# EAGLE design pneumatic_board2 (EAGLE 6.2)
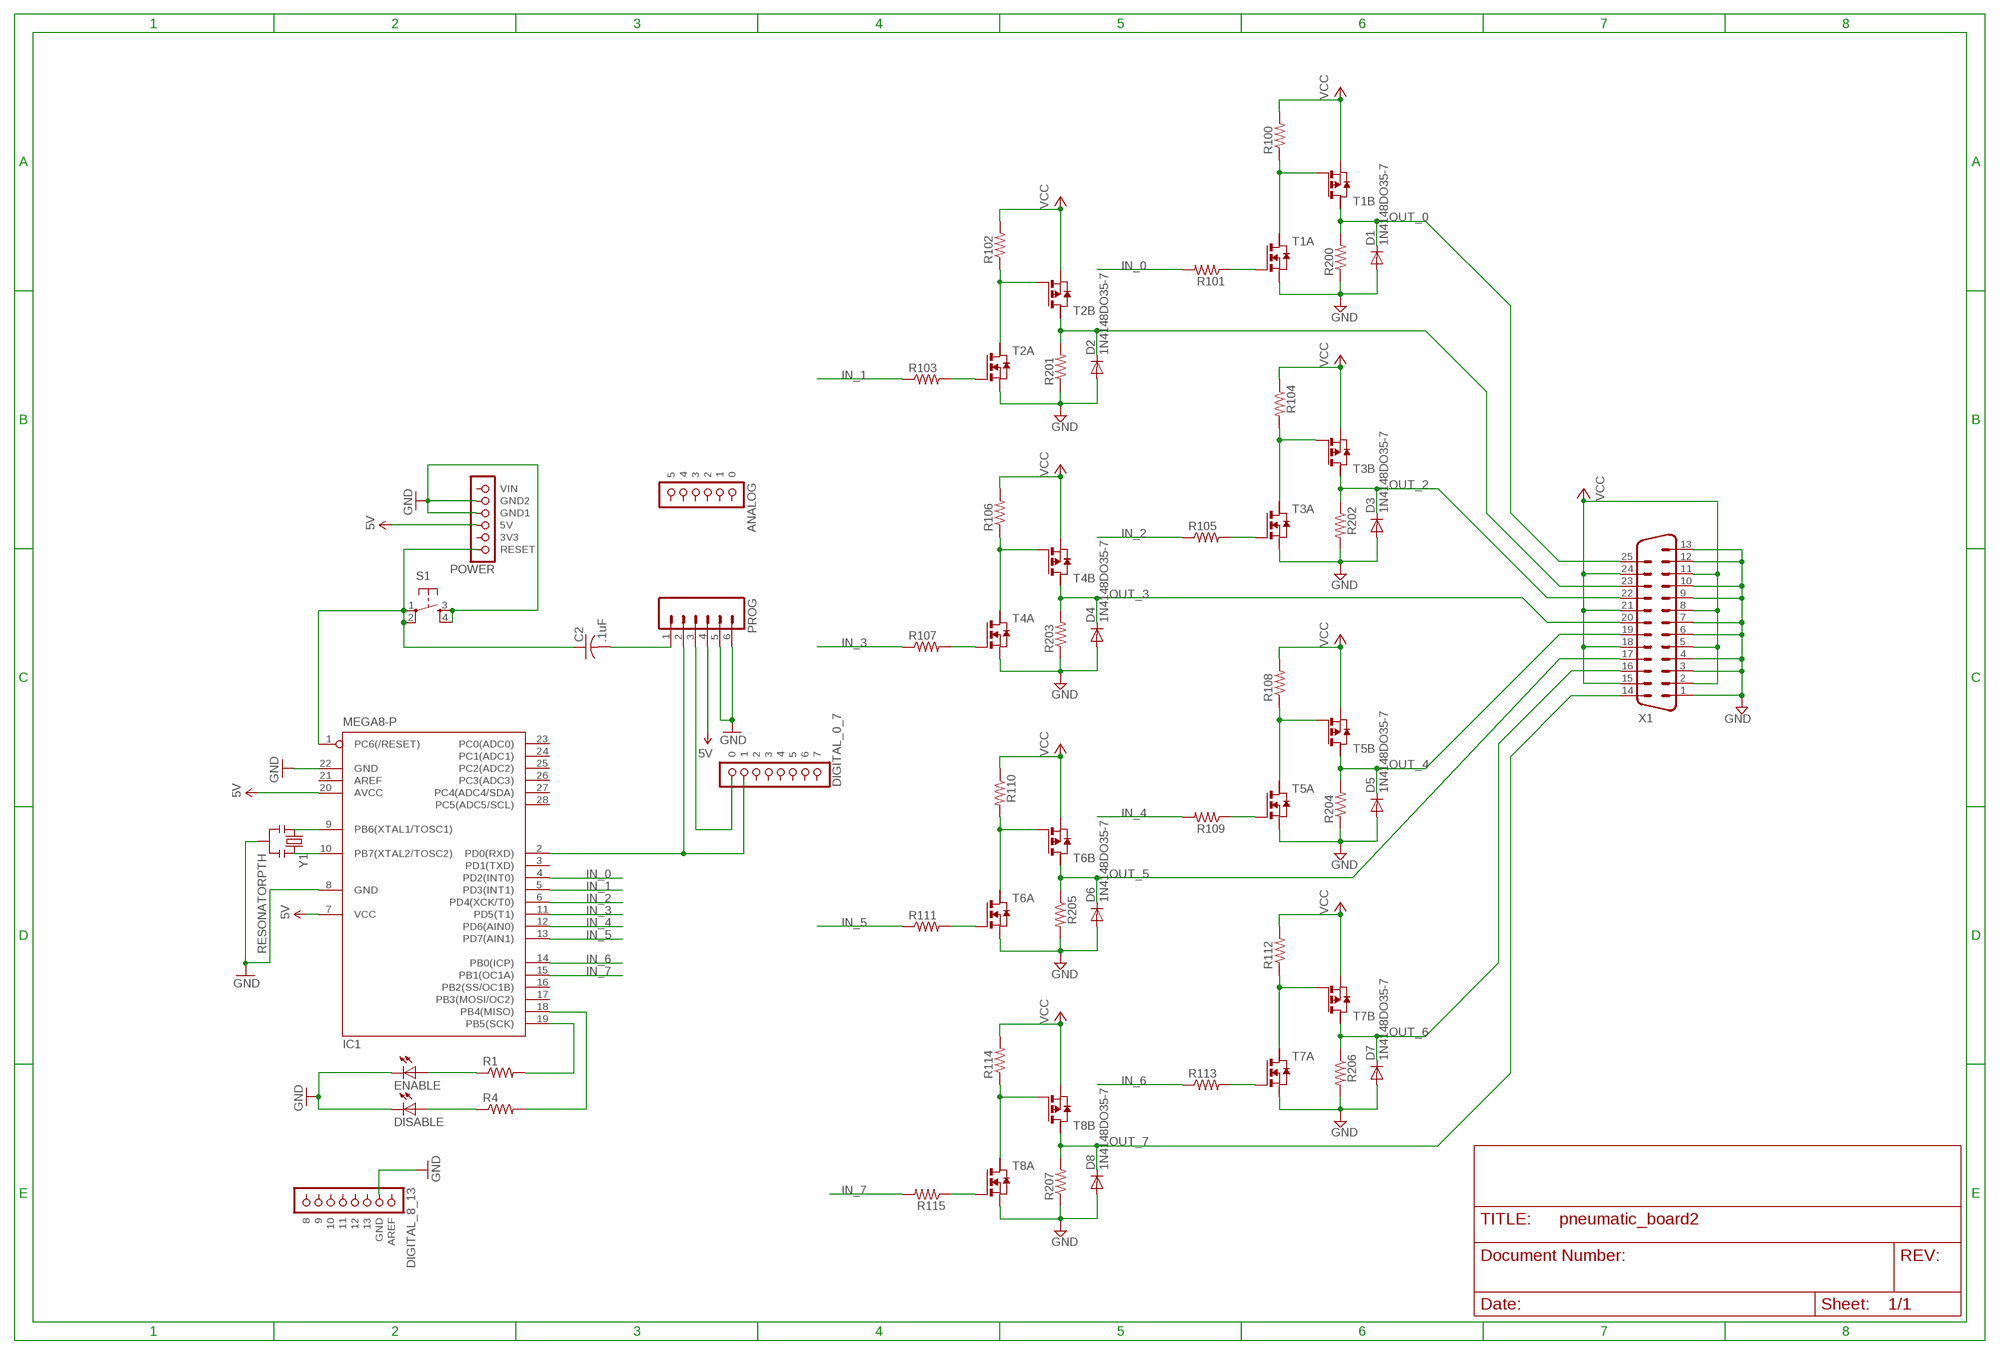
[diagram p0: schematic, sheet 1]

## Parts
C2  .1uF  C-US025-024X044  [C025-024X044]
D1  1N4148DO35-7  [DO35-7]
D2  1N4148DO35-7  [DO35-7]
D3  1N4148DO35-7  [DO35-7]
D4  1N4148DO35-7  [DO35-7]
D5  1N4148DO35-7  [DO35-7]
D6  1N4148DO35-7  [DO35-7]
D7  1N4148DO35-7  [DO35-7]
D8  1N4148DO35-7  [DO35-7]
DISABLE  LED5MM  [LED5MM]
ENABLE  LED5MM  [LED5MM]
IC1  MEGA8-P  [DIL28-3]
PROG  M06SIP_LOCK  [1X06-SIP_LOCK]
R1  RESISTORAXIAL-0.3  [AXIAL-0.3]
R4  RESISTORAXIAL-0.3  [AXIAL-0.3]
R100  RESISTORAXIAL-0.3  [AXIAL-0.3]
R101  RESISTORAXIAL-0.3  [AXIAL-0.3]
R102  RESISTORAXIAL-0.3  [AXIAL-0.3]
R103  RESISTORAXIAL-0.3  [AXIAL-0.3]
R104  RESISTORAXIAL-0.3  [AXIAL-0.3]
R105  RESISTORAXIAL-0.3  [AXIAL-0.3]
R106  RESISTORAXIAL-0.3  [AXIAL-0.3]
R107  RESISTORAXIAL-0.3  [AXIAL-0.3]
R108  RESISTORAXIAL-0.3  [AXIAL-0.3]
R109  RESISTORAXIAL-0.3  [AXIAL-0.3]
R110  RESISTORAXIAL-0.3  [AXIAL-0.3]
R111  RESISTORAXIAL-0.3  [AXIAL-0.3]
R112  RESISTORAXIAL-0.3  [AXIAL-0.3]
R113  RESISTORAXIAL-0.3  [AXIAL-0.3]
R114  RESISTORAXIAL-0.3  [AXIAL-0.3]
R115  RESISTORAXIAL-0.3  [AXIAL-0.3]
R200  RESISTORAXIAL-0.3  [AXIAL-0.3]
R201  RESISTORAXIAL-0.3  [AXIAL-0.3]
R202  RESISTORAXIAL-0.3  [AXIAL-0.3]
R203  RESISTORAXIAL-0.3  [AXIAL-0.3]
R204  RESISTORAXIAL-0.3  [AXIAL-0.3]
R205  RESISTORAXIAL-0.3  [AXIAL-0.3]
R206  RESISTORAXIAL-0.3  [AXIAL-0.3]
R207  RESISTORAXIAL-0.3  [AXIAL-0.3]
S1  TAC_SWITCHPTH  [TACTILE-PTH]
T1  PN_MOSFET-SO8  [SO8]
T2  PN_MOSFET-SO8  [SO8]
T3  PN_MOSFET-SO8  [SO8]
T4  PN_MOSFET-SO8  [SO8]
T5  PN_MOSFET-SO8  [SO8]
T6  PN_MOSFET-SO8  [SO8]
T7  PN_MOSFET-SO8  [SO8]
T8  PN_MOSFET-SO8  [SO8]
U$1  POWER  [1X06]
U$2  ANALOG  [1X06]
U$3  DIGITAL_0_7  [1X08]
U$4  DIGITAL_8_13  [1X08]
X1  M25VP  [M25VP]
Y1  RESONATORPTH  [RESONATOR-PTH]

## Nets
5V: IC1.7(VCC) IC1.20(AVCC) PROG.4 U$1.3(5V)
GND: D1.A D2.A D3.A D4.A D5.A D6.A D7.A D8.A DISABLE.K(C) ENABLE.K(C) IC1.8(GND) IC1.22(GND) PROG.5 PROG.6 R200.P$1 R201.P$1 R202.P$2 R203.P$1 R204.P$1 R205.P$2 R206.P$2 R207.P$1 S1.3 S1.4 T1.1(A:S) T2.1(A:S) T3.1(A:S) T4.1(A:S) T5.1(A:S) T6.1(A:S) T7.1(A:S) T8.1(A:S) U$1.4(GND1) U$1.5(GND2) U$4.2(GND) X1.1 X1.3 X1.4 X1.6 X1.7 X1.9 X1.10 X1.12 X1.13 Y1.2
IN_0: IC1.4(PD2(INT0)) R101.P$2
IN_1: IC1.5(PD3(INT1)) R103.P$1
IN_2: IC1.6(PD4(XCK/T0)) R105.P$1
IN_3: IC1.11(PD5(T1)) R107.P$1
IN_4: IC1.12(PD6(AIN0)) R109.P$2
IN_5: IC1.13(PD7(AIN1)) R111.P$1
IN_6: IC1.14(PB0(ICP)) R113.P$1
IN_7: IC1.15(PB1(OC1A)) R115.P$2
N$1: IC1.2(PD0(RXD)) PROG.2 U$3.7
N$2: IC1.9(PB6(XTAL1/TOSC1)) Y1.1
N$3: IC1.10(PB7(XTAL2/TOSC2)) Y1.3
N$4: IC1.19(PB5(SCK)) R1.P$2
N$5: IC1.18(PB4(MISO)) R4.P$2
N$7: R100.P$1 T1.4(B:G) T1.7(A:D)
N$8: R101.P$1 T1.2(A:G)
N$9: R104.P$2 T3.4(B:G) T3.7(A:D)
N$10: R102.P$1 T2.4(B:G) T2.7(A:D)
N$11: R103.P$2 T2.2(A:G)
N$14: R105.P$2 T3.2(A:G)
N$16: R106.P$1 T4.4(B:G) T4.7(A:D)
N$17: R107.P$2 T4.2(A:G)
N$19: R108.P$1 T5.4(B:G) T5.7(A:D)
N$20: R109.P$1 T5.2(A:G)
N$22: R110.P$2 T6.4(B:G) T6.7(A:D)
N$23: R111.P$2 T6.2(A:G)
N$24: PROG.3 U$3.8
N$25: ENABLE.A R1.P$1
N$26: DISABLE.A R4.P$1
N$27: R112.P$1 T7.4(B:G) T7.7(A:D)
N$29: R113.P$2 T7.2(A:G)
N$31: R114.P$1 T8.4(B:G) T8.7(A:D)
N$32: R115.P$1 T8.2(A:G)
N$33: C2.2 PROG.1
N$34: C2.1 IC1.1(PC6(/RESET)) S1.1 S1.2 U$1.1(RESET)
OUT_0: D1.C R200.P$2 T1.5(B:D) X1.25
OUT_1: D2.C R201.P$2 T2.5(B:D) X1.23
OUT_2: D3.C R202.P$1 T3.5(B:D) X1.22
OUT_3: D4.C R203.P$2 T4.5(B:D) X1.20
OUT_4: D5.C R204.P$2 T5.5(B:D) X1.19
OUT_5: D6.C R205.P$1 T6.5(B:D) X1.17
OUT_6: D7.C R206.P$1 T7.5(B:D) X1.16
OUT_7: D8.C R207.P$2 T8.5(B:D) X1.14
VCC: R100.P$2 R102.P$2 R104.P$1 R106.P$2 R108.P$2 R110.P$1 R112.P$2 R114.P$2 T1.3(B:S) T2.3(B:S) T3.3(B:S) T4.3(B:S) T5.3(B:S) T6.3(B:S) T7.3(B:S) T8.3(B:S) X1.2 X1.5 X1.8 X1.11 X1.15 X1.18 X1.21 X1.24
Unconnected: IC1.3(PD1(TXD)) IC1.16(PB2(SS/OC1B)) IC1.17(PB3(MOSI/OC2)) IC1.21(AREF) IC1.23(PC0(ADC0)) IC1.24(PC1(ADC1)) IC1.25(PC2(ADC2)) IC1.26(PC3(ADC3)) IC1.27(PC4(ADC4/SDA)) IC1.28(PC5(ADC5/SCL)) T1.6(B:D2) T1.8(A:D2) T2.6(B:D2) T2.8(A:D2) T3.6(B:D2) T3.8(A:D2) T4.6(B:D2) T4.8(A:D2) T5.6(B:D2) T5.8(A:D2) T6.6(B:D2) T6.8(A:D2) T7.6(B:D2) T7.8(A:D2) T8.6(B:D2) T8.8(A:D2) U$1.2(3V3) U$1.6(VIN) U$2.1 U$2.2 U$2.3 U$2.4 U$2.5 U$2.6 U$3.1 U$3.2 U$3.3 U$3.4 U$3.5 U$3.6 U$4.1(AREF) U$4.3 U$4.4 U$4.5 U$4.6 U$4.7 U$4.8 X1.G1 X1.G2

## Library data of the parts
C2 = rcl:C-US: CAPACITOR, American symbol
D1-D8 = diode:1N4148: DIODE high speed (Philips)
DISABLE ENABLE = SparkFun:LED: LEDs Standard schematic elements and footprints for 5mm, 3mm, 1206, and 0603 sized LEDs. 5mm - Spark Fun Electronics SKU : COM-00529 (and others)
IC1 = atmel:MEGA8-P: MICROCONTROLLER 8 Kbytes FLASH, 1 kbytes SRAM, 512 bytes EEPROM, USART, 4-channel 10 bit ADC, 2-channel 8 bit ADC Pin compatible with Atmega48, ATMega88, ATMega168 Source: avr.lbr; OC_FARNELL: unknown; OC_NEWARK: unknown
PROG = SparkFun:M06: Header 6 Standard 6-pin 0.1" header. Use with straight break away headers (SKU : PRT-00116), right angle break away headers (PRT-00553), swiss pins (PRT-00743), machine pins (PRT-00117), and female headers (PRT-00115). Molex polarized connector foot print use with SKU : PRT-08094 with associated crimp pins and housings. NOTES ON THE VARIANTS LOCK and LOCK_LONGPADS... This footprint was designed to help hold the alignment of a through-hole component (i.e. 6-pin header) while soldering it into place. You may notice that each hole has been shifted either up or down by 0.005 of an inch from it's more standard position (which is a perfectly straight line). This slight alteration caused the pins (the squares in the middle) to touch the edges of the holes. Because they are alternating, it causes a "brace" to hold the component in place. 0.005 has proven to be the perfect amount of "off-center" position when using our standard breakaway headers. Although looks a little odd when you look at the bare footprint, once you have a header in there, the alteration is very hard to notice. Also, if you push a header all the way into place, it is covered up entirely on the bottom side. This idea of altering the position of holes to aid alignment will be further integrated into the Sparkfun Library for other footprints. It can help hold any component with 3 or more connection pins.
R1 R4 R100-R115 R200-R207 = SparkFun:RESISTOR: Resistor Basic schematic elements and footprints for 0603, 1206, and PTH resistors.
S1 = SparkFun:TAC_SWITCH: Momentary Switch Button commonly used for reset or general input. Spark Fun Electronics SKU : COM-00097
T1-T8 = zetex:PN_MOSFET-: DUAL N AND P-CHANNEL ENHANCEMENT MODE MOSFET source ZXMD63C02.pdf from http://www.zetex.com/; OC_FARNELL: unknown; OC_NEWARK: unknown
U$1 = arduino:POWER
U$2 = arduino:ANALOG
U$3 = arduino:DIGITAL_0_7
U$4 = arduino:DIGITAL_8_13
X1 = con-subd:M25VP: SUB-D; OC_FARNELL: unknown; OC_NEWARK: unknown
Y1 = SparkFun:RESONATOR: Resonator Small SMD resonator. This is the itty bitty 10/20MHz resonators with built in caps. CSTCE10M0G55 and CSTCE20M0V53. Footprint has been reviewed closely but hasn't been tested yet.

## Board
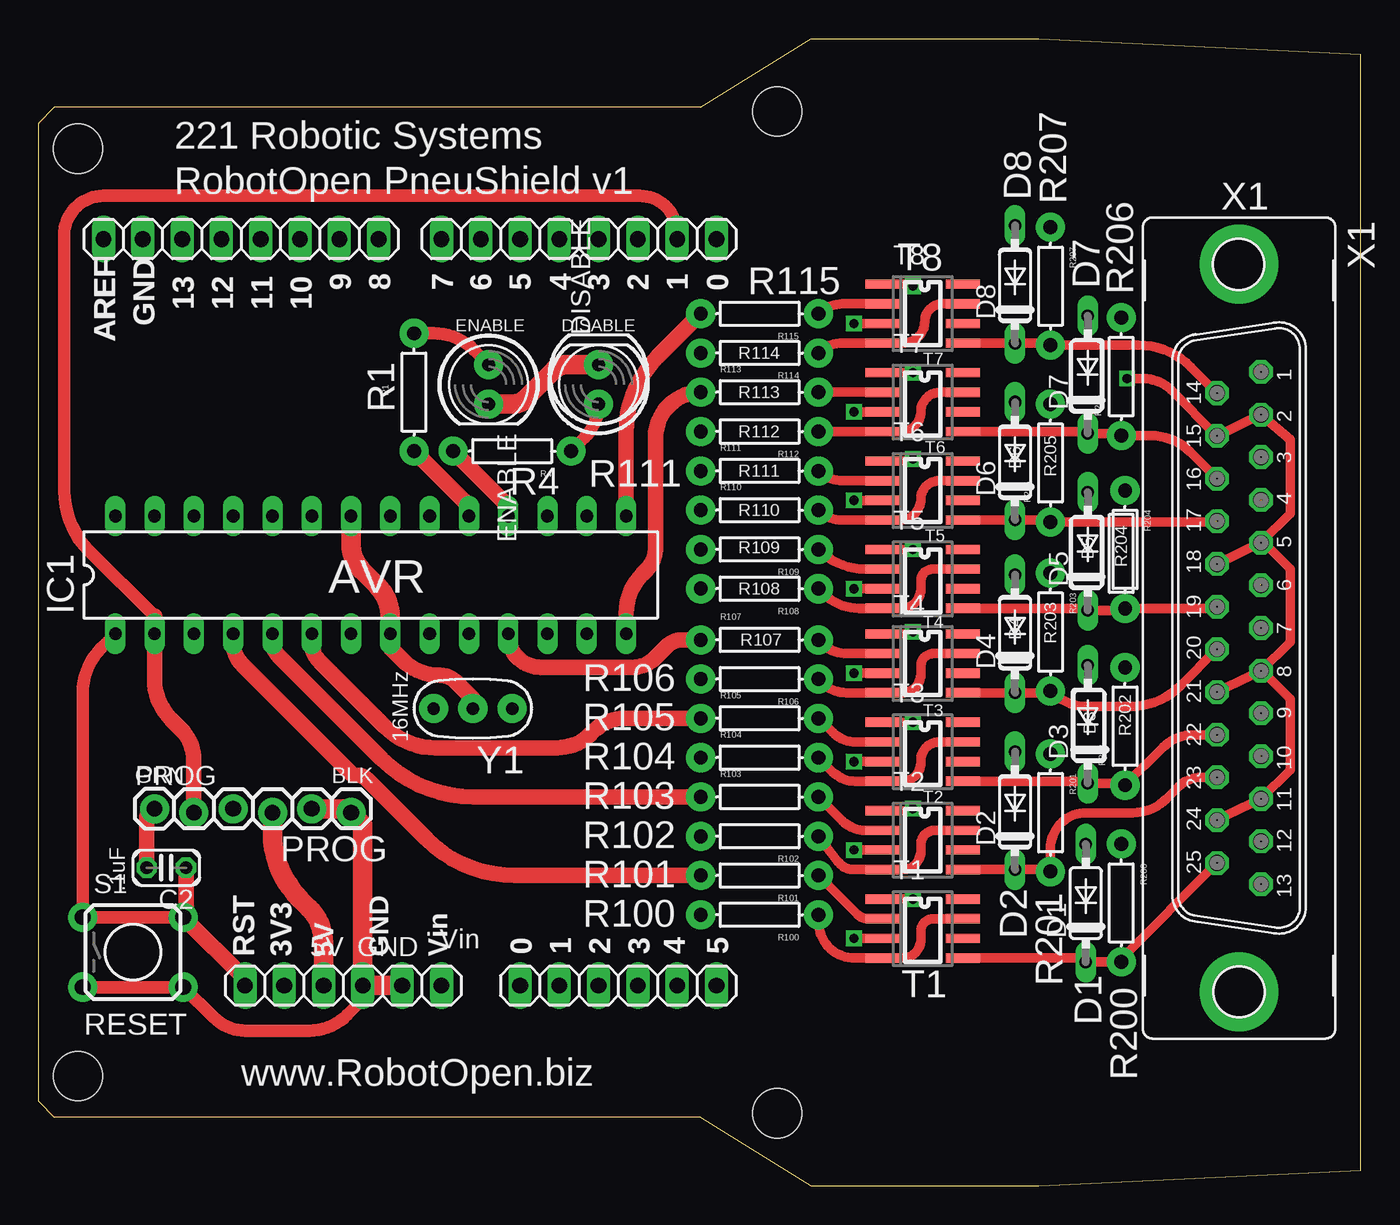
[diagram p1: board, top side]
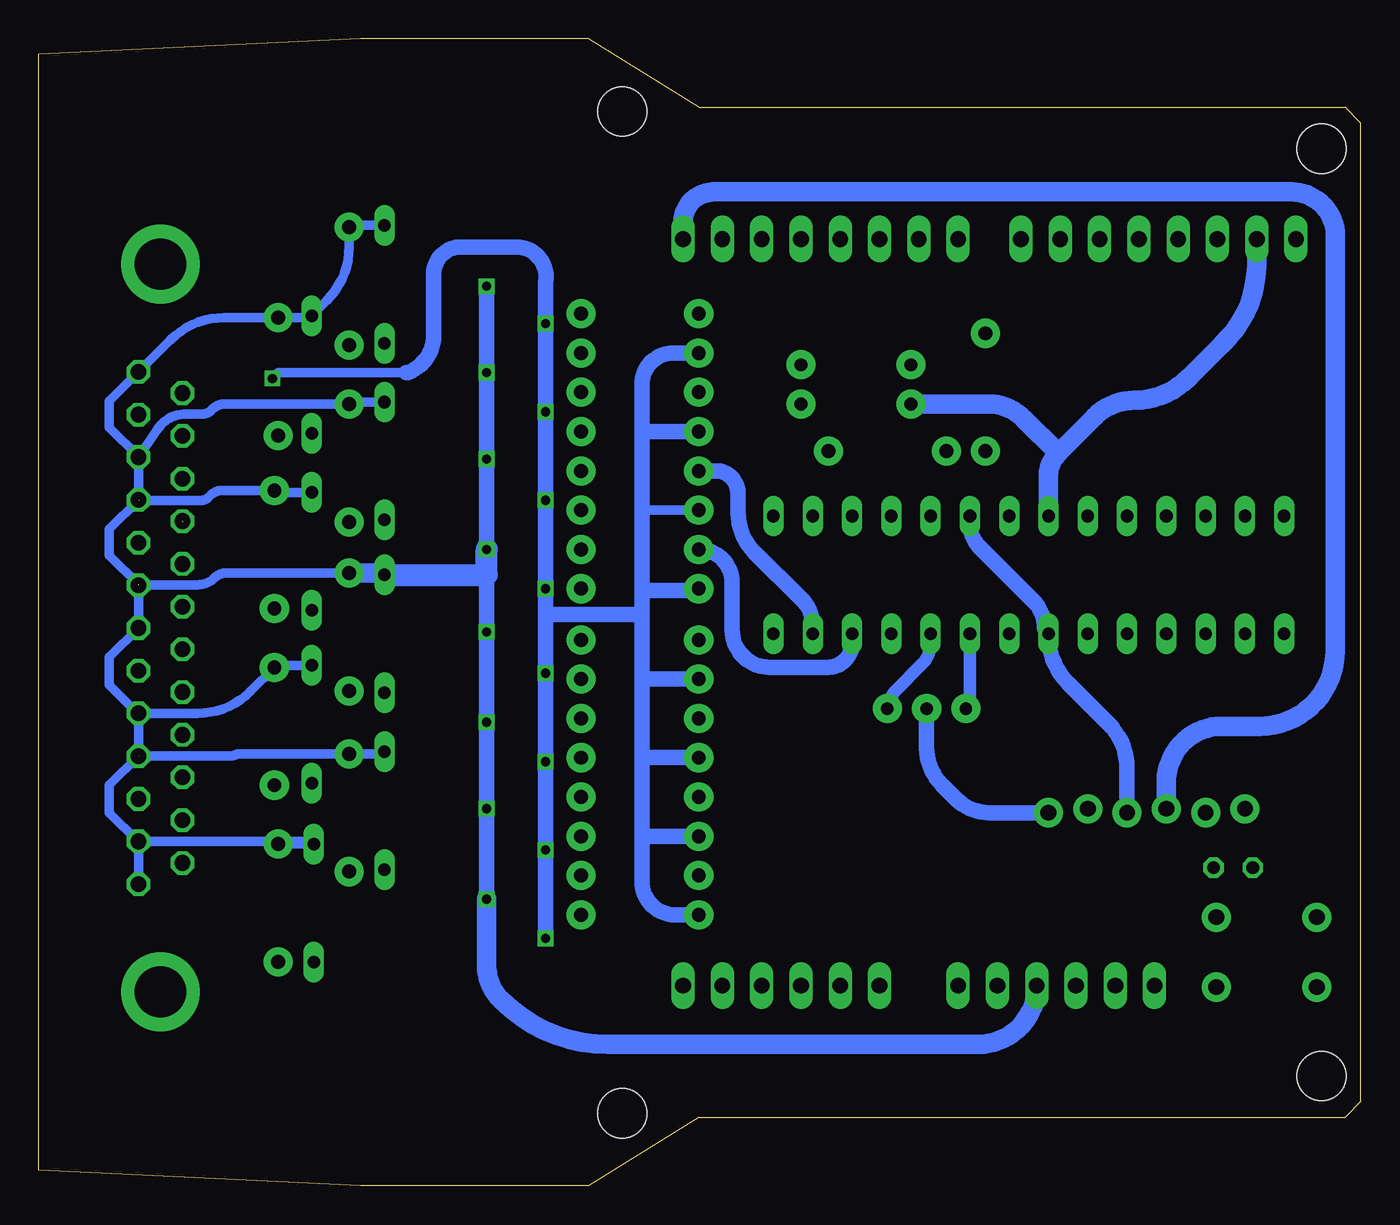
[diagram p2: board, bottom side, seen from below]

Size 85.47 x 74.17 mm. Coordinates in mm from the lower left corner, seen from the top.
Outline: 64.64,0 85.47,1.02 85.47,73.15 64.64,74.17 49.91,74.17 42.8,69.72 1.02,69.72 0,68.71 0,5.46 1.02,4.45 42.8,4.45 49.91,0 64.64,0
Copper layers (1*16): Top 0.035mm / dielectric 1.5mm / Bottom 0.035mm
Design rules: minimum track width 10mil, minimum drill 24mil, track to track 8mil, track to pad 8mil, pad to pad 8mil, via to via 8mil, smd to smd 8mil, copper to edge 40mil, drill to drill 8mil, minimum pad ring 10mil, minimum via ring 8mil, stop-mask expansion 4mil, vias tented up to drill 0mil, thermal gap 10mil
Holes 3.17 mm at 2.54,67.06 2.54,7.11 47.75,4.7 47.75,69.47

### Footprints (pad centres in the part's own frame; a part is rotated, then mirrored left to right if it is on the bottom)
C025-024X044 = drill 0.813 octagon: 1 -1.27,0; 2 1.27,0
DO35-7 = drill 0.813 long: A 3.81,0; C -3.81,0
LED5MM = drill 0.813 pad 1.88: A -1.27,0; K 1.27,0
DIL28-3 = drill 0.813 long: 1 -16.51,-3.81; 2 -13.97,-3.81; 3 -11.43,-3.81; 4 -8.89,-3.81; 5 -6.35,-3.81; 6 -3.81,-3.81; 7 -1.27,-3.81; 8 1.27,-3.81; 9 3.81,-3.81; 10 6.35,-3.81; 11 8.89,-3.81; 12 11.43,-3.81; 13 13.97,-3.81; 14 16.51,-3.81; 15 16.51,3.81; 16 13.97,3.81; 17 11.43,3.81; 18 8.89,3.81; 19 6.35,3.81; 20 3.81,3.81; 21 1.27,3.81; 22 -1.27,3.81; 23 -3.81,3.81; 24 -6.35,3.81; 25 -8.89,3.81; 26 -11.43,3.81; 27 -13.97,3.81; 28 -16.51,3.81
1X06-SIP_LOCK = drill 1.016 pad 1.88: 1 0,0; 2 2.54,-0.254; 3 5.08,0; 4 7.62,-0.254; 5 10.16,0; 6 12.7,-0.254
AXIAL-0.3 = drill 0.9 pad 1.88: P$1 -3.81,0; P$2 3.81,0
TACTILE-PTH = drill 1.016 pad 1.88: 1 -3.251,2.261; 2 3.251,2.261; 3 -3.251,-2.261; 4 3.251,-2.261
SO8 = smd 0.6 x 2.2: 1 -1.905,-2.6; 2 -0.635,-2.6; 3 0.635,-2.6; 4 1.905,-2.6; 5 1.905,2.6; 6 0.635,2.6; 7 -0.635,2.6; 8 -1.905,2.6
1X06 = drill 1.016 long: 1 -6.35,0; 2 -3.81,0; 3 -1.27,0; 4 1.27,0; 5 3.81,0; 6 6.35,0
1X08 = drill 1.016 long: 1 -8.89,0; 2 -6.35,0; 3 -3.81,0; 4 -1.27,0; 5 1.27,0; 6 3.81,0; 7 6.35,0; 8 8.89,0
M25VP = drill 1.016 octagon: 1 -16.561,1.422; 2 -13.792,1.422; 3 -11.049,1.422; 4 -8.28,1.422; 5 -5.512,1.422; 6 -2.769,1.422; 7 0,1.422; 8 2.769,1.422; 9 5.512,1.422; 10 8.28,1.422; 11 11.049,1.422; 12 13.792,1.422; 13 16.561,1.422; 14 -15.189,-1.422; 15 -12.421,-1.422; 16 -9.652,-1.422; 17 -6.909,-1.422; 18 -4.14,-1.422; 19 -1.372,-1.422; 20 1.372,-1.422; 21 4.14,-1.422; 22 6.909,-1.422; 23 9.652,-1.422; 24 12.421,-1.422; 25 15.189,-1.422 | drill 3.302 pad 5.08: G1 -23.52,0; G2 23.52,0
RESONATOR-PTH = drill 0.8 pad 1.88: 1 -2.54,0; 2 0,0; 3 2.54,0

### Placement (x,y rotation side)
C2  8.26,20.57 180 top
D1  67.69,18.29 90 top
D2  63.12,24.26 90 top
D3  67.82,29.84 90 top
D4  63.12,35.69 90 top
D5  67.82,41.02 90 top
D6  63.12,46.86 90 top
D7  67.82,52.45 90 top
D8  63.12,58.29 90 top
DISABLE  36.2,51.82 90 top
ENABLE  29.08,51.82 270 top
IC1  21.46,39.5 0 top
PROG  7.49,24.38 0 top
R1  24.26,51.31 270 top
R4  30.61,47.5 180 top
R100  46.61,17.53 180 top
R101  46.61,20.07 180 top
R102  46.61,22.61 180 top
R103  46.61,25.15 0 top
R104  46.61,27.69 0 top
R105  46.61,30.23 0 top
R106  46.61,32.77 180 top
R107  46.61,35.31 0 top
R108  46.61,38.61 180 top
R109  46.61,41.15 180 top
R110  46.61,43.69 0 top
R111  46.61,46.23 0 top
R112  46.61,48.77 180 top
R113  46.61,51.31 0 top
R114  46.61,53.85 180 top
R115  46.61,56.39 180 top
R200  69.98,18.29 270 top
R201  65.41,24.13 270 top
R202  70.23,29.72 90 top
R203  65.41,35.81 270 top
R204  70.23,41.15 270 top
R205  65.41,46.74 90 top
R206  69.98,52.32 90 top
R207  65.41,58.17 270 top
S1  6.1,15.11 0 top
T1  57.15,16.64 270 top
T2  57.15,22.35 270 top
T3  57.15,28.07 270 top
T4  57.15,33.78 270 top
T5  57.15,39.24 270 top
T6  57.15,44.96 270 top
T7  57.15,50.67 270 top
T8  57.15,56.39 270 top
U$1  19.69,12.95 0 top
U$2  37.47,12.95 0 top
U$3  34.93,61.21 0 top
U$4  13.08,61.21 0 top
X1  77.6,36.07 270 top
Y1  28.07,30.86 0 top

### Tracks (layer width: path | path; a pad name or v marks a point on that pad's centre or on a via)
5V
  Top 1.27: U$1.3 18.41,15.7 arc45 17.48,17.95 16.9,18.54 arc-45 15.11,22.84 PROG.4
  Bottom 0.254: 20.19,35.56 20.07,35.69
  Bottom 0.61: IC1.20 25.27,42.91 | 20.45,36.07 20.07,35.69 19.94,35.56 | 20.19,35.56 IC1.7
  Bottom 1.016: 25.27,42.91 arc-45 24.57,41.2 21.16,37.8 arc45 20.45,36.07 | PROG.4 15.11,27.01 arc-45 16.31,29.9 18.94,32.52 arc45 20.19,35.56
GND  (via drill 0.6)  (3 unrouted)
  Top 0.61: 25.88,33.02 25.86,33.02 | T8.1 56.52,58.29 v56.52,58.17 | v56.52,52.58 T7.1 | T6.1 56.52,46.86 v56.52,46.99 | T5.1 v56.52,41.15 | T4.1 56.52,35.69 v56.52,35.81 | T3.1 v56.52,29.97 | T2.1 56.52,24.26 v56.52,24.38 | T1.1 v56.52,18.54
  Top 0.813: S1.3 S1.4 11.3,10.9 arc45 13.39,10.03 17.49,10.03 arc45 19.94,11.05 20.95,12.06 U$1.4
  Top 1.016: Y1.2 28.07,31.5 27.01,32.55 arc45 25.88,33.02 | 25.86,33.02 arc-45 23.56,33.97 22.73,34.8 IC1.8
  Top 1.27: U$1.5 U$1.4 20.95,23.37 PROG.6 20.19,24.38 PROG.5 | ENABLE.K 30.69,50.55 arc45 31.41,50.84 33.35,52.78 arc-45 34.09,53.09 DISABLE.K | IC1.8 22.73,36.77 arc45 21.88,38.82 20.89,39.82 arc-45 20.19,41.5 IC1.22
  Bottom 0.61: D6.A 65.28,50.67 R205.P$2 73.44,50.55 arc-45 74.25,50.21 74.36,50.1 arc45 74.81,49.91 75.91,49.91 arc-56 77.81,48.9 X1.3 | D3.A 70.1,33.66 R202.P$2 71.79,31.97 arc45 75.2,30.56 X1.9 | D2.A 63.25,27.94 R201.P$1 72.64,27.94 72.66,27.93 arc45 72.93,27.81 78.99,27.81 | R200.P$1 D1.A 67.87,22.28 X1.12 | 63.25,39.62 D4.A | 78.99,44.32 74.91,44.32 arc-45 74.51,44.49 74.31,44.69 arc45 73.66,44.96 R204.P$1 70.1,44.83 D5.A | R203.P$1 73.35,39.62 arc-45 74.09,39.32 arc45 75.19,38.86 78.99,38.86 | D8.A 65.28,62.1 R207.P$1 65.41,60.72 arc45 66.85,57.23 D7.A 67.95,56.13 R206.P$2 73.47,56.13 arc-45 76.96,54.69 X1.1 80.9,50.75 80.9,49.02 79.02,47.14 X1.3 | X1.9 79.07,30.56 80.9,32.38 80.9,34.19 X1.7 X1.6 79.02,38.89 80.9,40.77 80.9,42.47 X1.4 X1.3 | X1.9 X1.10 80.9,25.91 80.9,24.13 79.05,22.28 X1.12 | X1.13 X1.12
  Bottom 1.016: PROG.6 24.05,24.13 arc45 26.14,25 27.07,25.93 arc45 28.07,28.33 Y1.2 | v56.52,58.17 v56.52,52.58 v56.52,46.99 v56.52,41.15 v56.52,35.81 v56.52,29.97 v56.52,24.38 v56.52,18.54
  Bottom 1.27: R203.P$1 63.25,39.62 | v56.52,18.54 56.52,14.28 arc-45 55.58,12.02 arc-45 48.64,9.14 24.77,9.14 arc-90 U$1.4 | IC1.22 20.19,45.91 arc45 19.61,47.32 19.56,47.37 | 19.56,47.37 17.19,49.73 arc45 14.62,50.8 arc-45 11.12,52.25 8.96,54.42 arc-45 6.73,59.43 U$4.2 | ENABLE.K 24.05,50.55 arc45 21.8,49.61 19.56,47.37
  Bottom 1.422: D4.A 56.52,39.5 v56.52,41.15
IN_0
  Top 0.61: 20.54,26.54 20.62,26.54
  Top 1.016: IC1.4 12.57,35.12 arc45 13.16,33.7 20.17,26.7 arc45 20.54,26.54 | 20.62,26.54 arc-45 21.19,26.31 25.07,22.43 arc45 30.78,20.07 R101.P$2
IN_1
  Top 1.016: IC1.5 15.11,35.21 arc45 15.49,34.29 22.19,27.6 arc45 28.11,25.15 R103.P$1
IN_2
  Top 0.61: 35.72,29.24 35.91,29.43
  Top 1.016: IC1.6 17.65,35.13 arc45 18.16,33.91 22.4,29.68 arc45 25.66,28.32 33.5,28.32 arc45 35.72,29.24 | 35.91,29.43 arc-45 37.83,30.23 R105.P$1
IN_3
  Top 0.61: IC1.11 30.35,35.64
  Top 1.016: 30.35,35.64 arc90 32.47,33.53 38.4,33.53 arc45 39.84,34.12 40.59,34.87 arc-45 41.64,35.31 R107.P$1
IN_4
  Bottom 1.016: IC1.12 32.89,35.08 arc90 34.44,33.53 38.23,33.53 arc90 40.64,35.94 40.64,38.99 arc-90 R109.P$2
IN_5
  Bottom 1.016: R111.P$1 41.71,46.23 arc90 40.26,44.78 40.26,43.51 arc-45 39.22,40.99 36.12,37.9 arc45 35.43,36.24 IC1.13
IN_6
  Top 0.61: IC1.14 37.97,37.01
  Top 1.016: 37.97,37.01 arc-45 39.02,39.52 39.24,39.75 arc45 39.88,41.28 39.88,48.39 arc-90 R113.P$1
IN_7
  Top 1.016: IC1.15 37.97,48.72 arc-45 39.99,53.58 R115.P$2
N$1
  Top 0.813: 7.49,36.83 3.25,41.08 arc-45 1.65,44.93 1.65,61.47 arc-90 4.19,64.01 38.85,64.01 arc-90 41.27,61.58 U$3.7
  Top 1.016: PROG.2 10.03,27.51 arc45 9.19,29.54 8.54,30.2 arc-45 7.49,32.72 IC1.2 7.49,36.83
N$2
  Bottom 0.813: Y1.1 25.27,31.11 IC1.9
N$3
  Bottom 0.813: IC1.10 27.81,35.09 arc45 28.38,33.73 30.06,32.04 arc-45 30.48,31.04 30.48,30.99 Y1.3
N$4
  Top 0.61: IC1.19 27.81,43.94
  Top 1.016: 27.81,43.94 R1.P$2
N$5
  Top 0.61: IC1.18 30.35,43.94
  Top 1.016: 30.35,43.94 R4.P$2
N$7
  Top 0.61: T1.7 57.84,17.27 arc90 57.02,16.46 57.02,15.9 arc-90 55.85,14.73 T1.4 52.75,14.73 arc-90 50.42,17.06 R100.P$1
N$8
  Top 0.61: T1.2 53.62,17.27 arc-45 52.92,17.56 R101.P$1
N$9
  Top 0.61: T3.7 58.22,28.7 arc90 57.02,27.5 57.02,27.36 arc-90 55.83,26.16 T3.4 52.77,26.16 arc-45 51.36,26.74 R104.P$2
N$10
  Top 0.61: T2.7 57.94,22.99 arc90 57.02,22.07 57.02,21.62 arc-90 55.85,20.45 T2.4 52.72,20.45 arc-53 51.68,20.96 R102.P$1
N$11
  Top 0.61: T2.2 53.44,22.99 arc-45 51.97,23.6 R103.P$2
N$14
  Top 0.61: T3.2 52.81,28.7 arc-45 51.33,29.31 R105.P$2
N$16
  Top 0.61: T4.7 57.84,34.42 arc90 57.02,33.6 57.02,33.08 arc-90 55.82,31.88 T4.4 52.23,31.88 arc-45 50.66,32.53 R106.P$1
N$17
  Top 0.61: T4.2 52.25,34.42 arc-45 50.64,35.08 R107.P$2
N$19
  Top 0.61: R108.P$1 50.75,38.28 arc45 53.02,37.34 T5.4 55.77,37.34 arc90 57.02,38.59 57.02,39.1 arc-90 57.8,39.88 T5.7
N$20
  Top 0.61: T5.2 53.44,39.88 arc-45 50.45,41.11 R109.P$1
N$22
  Top 0.61: R110.P$2 50.45,43.65 arc45 51.9,43.05 T6.4 55.68,43.05 arc90 57.02,44.4 arc-90 58.22,45.59 T6.7
N$23
  Top 0.61: T6.2 51.95,45.59 arc-45 R111.P$2
N$24
  Bottom 1.27: PROG.3 12.57,26.13 arc90 8.98,29.72 6.53,29.72 arc-90 1.65,34.6 1.65,61.42 arc-90 4.49,64.26 41.83,64.26 arc-90 43.81,62.28 U$3.8
N$25
  Top 0.813: R1.P$1 25.5,55.12 arc-45 28.15,54.02 ENABLE.A
N$26
  Top 0.813: R4.P$1 35.3,48.38 arc45 DISABLE.A
N$27
  Top 0.61: R112.P$1 T7.4 55.75,48.77 arc90 57.02,50.04 arc-90 58.29,51.31 T7.7
N$29
  Top 0.61: T7.2 R113.P$2
N$31
  Top 0.61: R114.P$1 arc-45 51.95,54.48 T8.4 55.87,54.48 arc90 57.28,55.89 arc-90 58.41,57.02 T8.7
N$32
  Top 0.61: T8.2 51.95,57.02 arc45 R115.P$1
N$33
  Top 1.016: C2.2 6.99,23.88 PROG.1
N$34
  Top 0.813: IC1.1 4.05,34.78 arc45 2.85,31.88 S1.1 S1.2 9.53,17.55 | 13.34,13.39 U$1.1
  Top 1.016: S1.2 13.34,13.39 | 9.53,17.55 C2.1
OUT_0
  Top 0.61: T1.5 67.44,14.73 D1.C R200.P$2 69.98,14.68 X1.25
OUT_1
  Top 0.61: T2.5 D2.C 65.28,20.45 R201.P$2 65.41,21.79 arc-90 67.75,24.13 70.74,24.13 arc45 72.91,25.03 73.7,25.82 arc-45 75.14,26.42 X1.23
OUT_2
  Top 0.61: T3.5 67.69,26.16 D3.C 70.1,26.04 R202.P$1 72.68,28.36 arc-45 74.61,29.16 X1.22
OUT_3
  Top 0.61: T4.5 D4.C 65.41,31.88 R203.P$2 arc45 67.86,30.99 70.53,30.99 arc45 73.84,32.36 X1.20
OUT_4
  Top 0.61: T5.5 67.69,37.34 arc-90 D5.C 70.1,37.21 arc90 R204.P$2 76.07,37.34 X1.19
OUT_5  (1 unrouted)
  Top 0.61: T6.5 D6.C 65.28,43.05 R205.P$1 76.12,42.93
OUT_6
  Top 0.61: T7.5 67.69,48.77 D7.C 69.85,48.64 R206.P$1 71.89,48.51 arc-45 74.44,47.46 X1.16
OUT_7
  Top 0.61: T8.5 D8.C 65.28,54.48 R207.P$2 71.08,54.36 arc-45 74.49,52.94 X1.14
VCC  (via drill 0.6)
  Top 0.61: T8.3 v52.7,55.75 | v52.7,44.32 T6.3 | T4.3 v52.7,33.15 | v52.7,16 T1.3 | T2.3 v52.7,21.72 | T7.3 v52.7,50.04 | T5.3 v52.7,38.61 | T3.3 v52.7,27.43 | v70.36,52.2 71.41,52.2 arc-45 73.21,51.45 X1.15 X1.2 80.9,48.26 80.9,43.46 X1.5 | X1.24 X1.11 80.9,26.9 80.9,31.5 79.1,33.3 X1.8 | X1.8 X1.21 | X1.8 80.9,35.18 80.9,39.88 79.2,41.58 X1.5 | X1.5 X1.18
  Bottom 0.61: v70.36,52.2 69.98,52.58 61.72,52.58 | 52.7,58.8 52.7,58.42 | R110.P$1 46.48,43.69 | R108.P$2 42.8,38.48 | 46.36,32.77 arc-90 46.48,32.64 | 46.36,27.69 arc-90 46.48,27.56 | 46.36,22.61 arc-90 46.48,22.48
  Bottom 1.016: v52.7,16 v52.7,21.72 v52.7,27.43 v52.7,33.15 52.7,36.96 | 52.7,36.96 v52.7,38.61 v52.7,44.32 v52.7,50.04 v52.7,55.75 52.7,58.42 arc-100 54.61,60.71 58.17,60.71 arc-90 59.94,58.93 59.94,54.99 arc69 61.59,52.58 arc42 61.72,52.58 | R100.P$2 44.33,17.53 arc90 46.48,19.68 46.48,22.48 46.48,27.56 46.48,32.64 46.48,36.96 | 46.48,36.96 46.48,38.48 | 46.48,38.48 46.48,43.69 46.48,48.77 | 46.48,48.77 46.48,51.8 arc90 44.43,53.85 R114.P$2 | R112.P$2 46.48,48.77 | 42.8,38.48 46.48,38.48 | R106.P$2 46.36,32.77 | R104.P$1 46.36,27.69 | R102.P$2 46.36,22.61 | 52.7,36.96 46.48,36.96

### Text on the board
tNames: 9 | 8 | 7 | 6 | 5 | 4 | 3 | 2 | 1 | 0 | 13 | 12 | 11 | 10 | GND | AREF | RST | 3V3 | 5V | GND | Vin | 0 | 1 | 2 | 3 | 4 | 5
ArduinoHoles: 3.2mm | 3.2mm | 3.2mm | 3.2mm | 3.2mm
_tsilk: 221 Robotic Systems | X1 | RobotOpen PneuShield v1 | D8 | R207 | T8 | 9 | 8 | 7 | 6 | 5 | 4 | 3 | 2 | 1 | 0 | R115 | D7 | R206 | 13 | 12 | 11 | 10 | GND | AREF | ENABLE | DISABLE | R114 | T7 | R113 | R1 | R112 | T6 | R4 | R111 | D6 | R205 | R111 | R110 | T5 | AVR | R109 | D5 | R204 | R108 | T4 | R107 | D4 | R203 | 16MHz | R106 | T3 | R105 | D3 | R202 | Y1 | R104 | GRN | BLK | T2 | R103 | R102 | PROG | .1uF | R101 | R100 | D2 | RST | 3V3 | 5V | GND | Vin | 0 | 1 | 2 | 3 | 4 | 5 | R201 | T1 | RESET | D1 | R200 | www.RobotOpen.biz